# Altium schematic sheet Sheet3.SchDoc
size A4
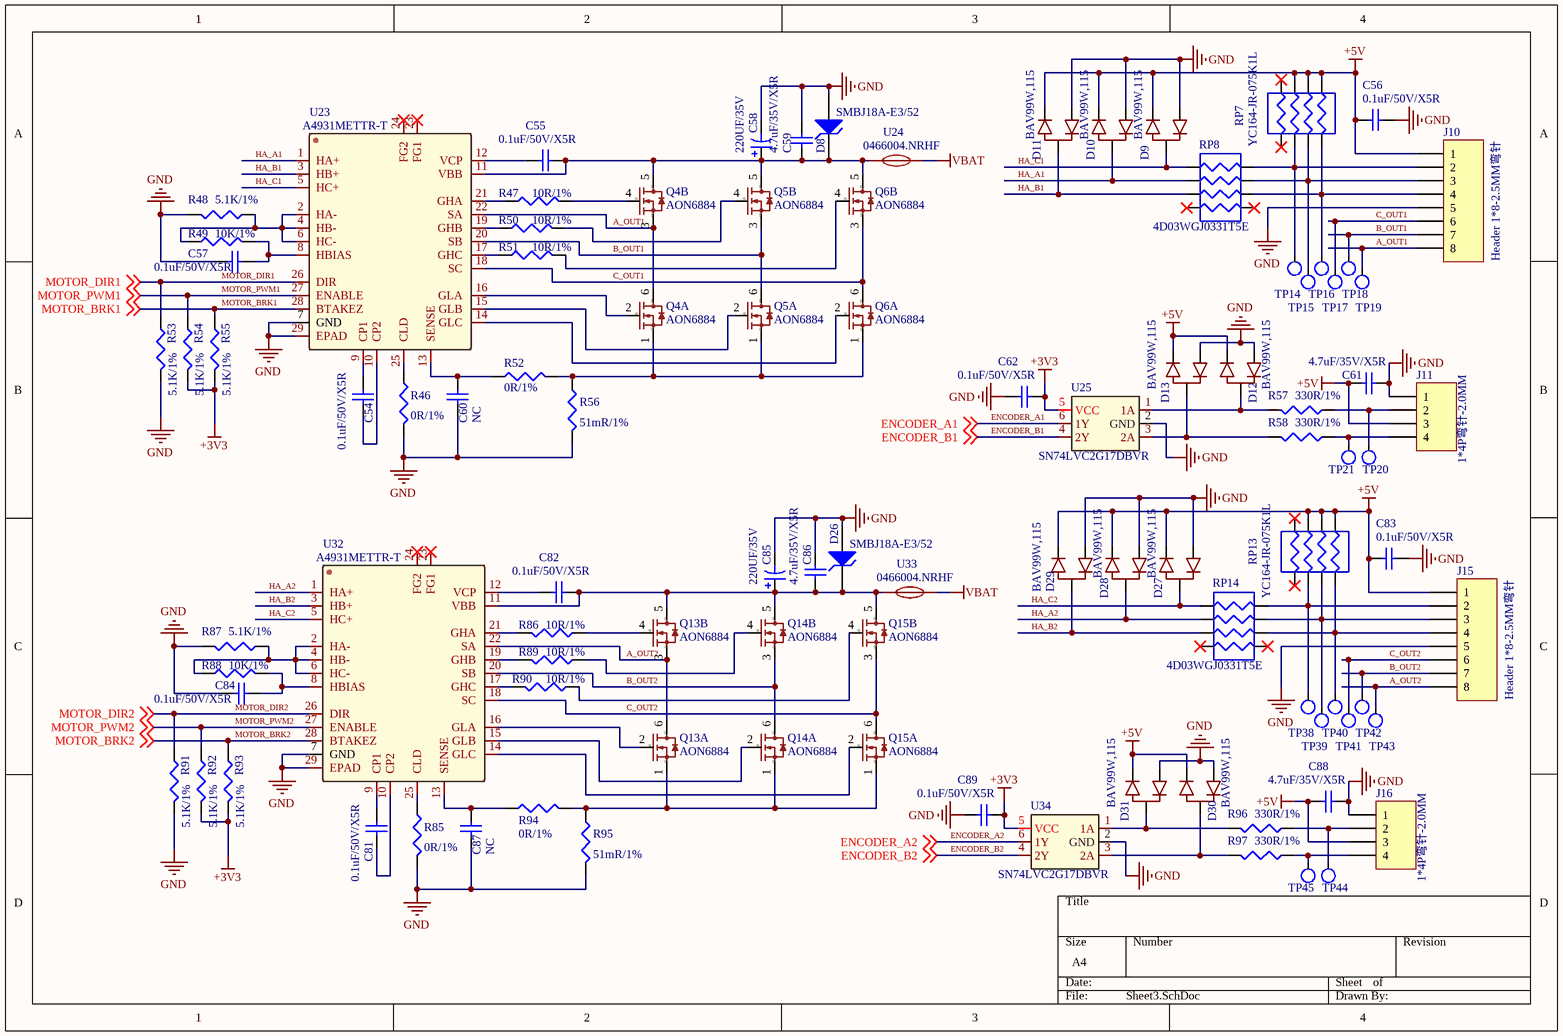
[diagram p0: Sheet3.SchDoc]

## Parts
C54  0.1uF/50V/X5R  [C0603]
C55  0.1uF/50V/X5R  [C0603]
C56  0.1uF/50V/X5R  [C0603]
C57  0.1uF/50V/X5R  [C0603]
C58  220UF/35V  [SMD_8X10.2]
C59  4.7uF/35V/X5R  [C0805]
C60  NC  [C0603]
C61  4.7uF/35V/X5R  [C0603]
C62  0.1uF/50V/X5R  [C0603]
C81  0.1uF/50V/X5R  [C0603]
C82  0.1uF/50V/X5R  [C0603]
C83  0.1uF/50V/X5R  [C0603]
C84  0.1uF/50V/X5R  [C0603]
C85  220UF/35V  [SMD_8X10.2]
C86  4.7uF/35V/X5R  [C0805]
C87  NC  [C0603]
C88  4.7uF/35V/X5R  [C0603]
C89  0.1uF/50V/X5R  [C0603]
D8  SMBJ18A-E3/52  [SMB]
D9  BAV99W,115
D10  BAV99W,115
D11  BAV99W,115
D12  BAV99W,115
D13  BAV99W,115
D26  SMBJ18A-E3/52  [SMB]
D27  BAV99W,115
D28  BAV99W,115
D29  BAV99W,115
D30  BAV99W,115
D31  BAV99W,115
J10  Header 1*8-2.5MM弯针  [DIP_8X2.5]
J11  1*4P弯针-2.0MM  [DIP_4X2MM]
J15  Header 1*8-2.5MM弯针  [DIP_8X2.5]
J16  1*4P弯针-2.0MM  [DIP_4X2MM]
Q4  AON6884  [AOS]  (parts A,B of 2)
Q5  AON6884  [AOS]  (parts A,B of 2)
Q6  AON6884  (parts A,B of 2)
Q13  AON6884  [AOS]  (parts A,B of 2)
Q14  AON6884  [AOS]  (parts A,B of 2)
Q15  AON6884  [AOS]  (parts A,B of 2)
R46  0R/1%  [R0603]
R47  10R/1%  [R0603]
R48  5.1K/1%  [R0603]
R49  10K/1%  [R0603]
R50  10R/1%  [R0603]
R51  10R/1%  [R0603]
R52  0R/1%  [R0603]
R53  5.1K/1%  [R0603]
R54  5.1K/1%  [R0603]
R55  5.1K/1%  [R0603]
R56  51mR/1%  [R0805]
R57  330R/1%  [R0603]
R58  330R/1%  [R0603]
R85  0R/1%  [R0603]
R86  10R/1%  [R0603]
R87  5.1K/1%  [R0603]
R88  10K/1%  [R0603]
R89  10R/1%  [R0603]
R90  10R/1%  [R0603]
R91  5.1K/1%  [R0603]
R92  5.1K/1%  [R0603]
R93  5.1K/1%  [R0603]
R94  0R/1%  [R0603]
R95  51mR/1%  [R0805]
R96  330R/1%  [R0603]
R97  330R/1%  [R0603]
RP7  YC164-JR-075K1L  [RP-1206]
RP8  4D03WGJ0331T5E  [RP-1206]
RP13  YC164-JR-075K1L  [RP-1206]
RP14  4D03WGJ0331T5E  [RP-1206]
TP14  TP  [TP]  (value not drawn)
TP15  TP  [TP]  (value not drawn)
TP16  TP  [TP]  (value not drawn)
TP17  TP  [TP]  (value not drawn)
TP18  TP  [TP]  (value not drawn)
TP19  TP  [TP]  (value not drawn)
TP20  TP  [TP]  (value not drawn)
TP21  TP  [TP]  (value not drawn)
TP38  TP  [TP]  (value not drawn)
TP39  TP  [TP]  (value not drawn)
TP40  TP  [TP]  (value not drawn)
TP41  TP  [TP]  (value not drawn)
TP42  TP  [TP]  (value not drawn)
TP43  TP  [TP]  (value not drawn)
TP44  TP  [TP]  (value not drawn)
TP45  TP  [TP]  (value not drawn)
U23  A4931METTR-T  [QFN-28]
U24  0466004.NRHF  [1206]
U25  SN74LVC2G17DBVR  [SOT-23-6]
U32  A4931METTR-T  [QFN-28]
U33  0466004.NRHF  [1206]
U34  SN74LVC2G17DBVR  [SOT-23-6]

## Nets
+3V3: C62.1 C89.1 R54.2 R55.2 R92.2 R93.2 U25.5(VCC) U34.5(VCC)
+5V: C56.1 C61.2 C83.1 C88.1 D9.2 D10.2 D11.2 D12.2 D13.2 D27.2 D28.2 D29.2 D30.2 D31.2 J10.1 J11.3 J15.1 J16.3 RP7.1 RP7.2 RP7.3 RP13.1 RP13.2 RP13.3
GND: C56.2 C57.2 C58.2 C59.2 C60.2 C61.1 C62.2 C83.2 C84.1 C85.2 C86.2 C87.2 C88.2 C89.2 D8.1(A) D9.1 D10.1 D11.1 D12.1 D13.1 D26.1(A) D27.1 D28.1 D29.1 D30.1 D31.1 J10.5 J11.1 J15.5 J16.1 R46.2 R48.2 R53.2 R56.2 R85.2 R87.2 R91.2 R95.2 U23.7(GND) U23.29(EPAD) U25.2(GND) U32.7(GND) U32.29(EPAD) U34.2(GND)
VBAT: U24.2 U33.2
A_OUT1: J10.8 Q4.3(S) Q4.6 TP19.1 U23.22(SA)
A_OUT2: J15.8 Q13.3(S) Q13.6 TP43.1 U32.22(SA)
B_OUT1: J10.7 Q5.3(S) Q5.6 TP18.1 U23.20(SB)
B_OUT2: J15.7 Q14.3(S) Q14.6 TP42.1 U32.20(SB)
C_OUT1: J10.6 Q6.3(S) Q6.6 TP17.1 U23.18(SC)
C_OUT2: J15.6 Q15.3(S) Q15.6 TP41.1 U32.18(SC)
ENCODER_A1: U25.6(1Y) ; off-sheet ENCODER_A1
ENCODER_A2: U34.6(1Y) ; off-sheet ENCODER_A2
ENCODER_B1: U25.4(2Y) ; off-sheet ENCODER_B1
ENCODER_B2: U34.4(2Y) ; off-sheet ENCODER_B2
HA_A1: D10.3 RP8.2 U23.1(HA+)
HA_A2: D28.3 RP14.2 U32.1(HA+)
HA_B1: D11.3 RP8.3 U23.3(HB+)
HA_B2: D29.3 RP14.3 U32.3(HB+)
HA_C1: D9.3 RP8.1 U23.5(HC+)
HA_C2: D27.3 RP14.1 U32.5(HC+)
MOTOR_BRK1: R55.1 U23.28(BTAKEZ) ; off-sheet MOTOR_BRK1
MOTOR_BRK2: R93.1 U32.28(BTAKEZ) ; off-sheet MOTOR_BRK2
MOTOR_DIR1: R53.1 U23.26(DIR) ; off-sheet MOTOR_DIR1
MOTOR_DIR2: R91.1 U32.26(DIR) ; off-sheet MOTOR_DIR2
MOTOR_PWM1: R54.1 U23.27(ENABLE) ; off-sheet MOTOR_PWM1
MOTOR_PWM2: R92.1 U32.27(ENABLE) ; off-sheet MOTOR_PWM2
NetC54_1: C54.1 U23.9(CP1)
NetC54_2: C54.2 U23.10(CP2)
NetC55_1: C55.1 U23.12(VCP)
NetC55_2: C55.2 C58.1 C59.1 D8.2(K) Q4.5(D) Q5.5(D) Q6.5(D) U23.11(VBB) U24.1
NetC57_1: C57.1 R49.2 U23.8(HBIAS)
NetC60_1: C60.1 R52.1 U23.13(SENSE)
NetC81_1: C81.1 U32.9(CP1)
NetC81_2: C81.2 U32.10(CP2)
NetC82_1: C82.1 U32.12(VCP)
NetC82_2: C82.2 C85.1 C86.1 D26.2(K) Q13.5(D) Q14.5(D) Q15.5(D) U32.11(VBB) U33.1
NetC84_2: C84.2 R88.2 U32.8(HBIAS)
NetC87_1: C87.1 R94.1 U32.13(SENSE)
NetD12_3: D12.3 R57.2 U25.1(1A)
NetD13_3: D13.3 R58.2 U25.3(2A)
NetD30_3: D30.3 R97.2 U34.3(2A)
NetD31_3: D31.3 R96.2 U34.1(1A)
NetJ10_2: J10.2 RP7.6 RP8.8 TP14.1
NetJ10_3: J10.3 RP7.7 RP8.7 TP15.1
NetJ10_4: J10.4 RP7.8 RP8.6 TP16.1
NetJ11_2: J11.2 R57.1 TP20.1
NetJ11_4: J11.4 R58.1 TP21.1
NetJ15_2: J15.2 RP13.6 RP14.8 TP38.1
NetJ15_3: J15.3 RP13.7 RP14.7 TP39.1
NetJ15_4: J15.4 RP13.8 RP14.6 TP40.1
NetJ16_2: J16.2 R96.1 TP44.1
NetJ16_4: J16.4 R97.1 TP45.1
NetQ4_1: Q4.1(S) Q5.1(S) Q6.1(S) R52.2 R56.1
NetQ4_2: Q4.2(G) U23.16(GLA)
NetQ4_4: Q4.4(G) R47.2
NetQ5_2: Q5.2(G) U23.15(GLB)
NetQ5_4: Q5.4(G) R50.2
NetQ6_2: Q6.2(G) U23.14(GLC)
NetQ6_4: Q6.4(G) R51.2
NetQ13_1: Q13.1(S) Q14.1(S) Q15.1(S) R94.2 R95.1
NetQ13_2: Q13.2(G) U32.16(GLA)
NetQ13_4: Q13.4(G) R86.1
NetQ14_2: Q14.2(G) U32.15(GLB)
NetQ14_4: Q14.4(G) R89.1
NetQ15_2: Q15.2(G) U32.14(GLC)
NetQ15_4: Q15.4(G) R90.1
NetR46_1: R46.1 U23.25(CLD)
NetR47_1: R47.1 U23.21(GHA)
NetR48_1: R48.1 R49.1 U23.2(HA-) U23.4(HB-) U23.6(HC-)
NetR50_1: R50.1 U23.19(GHB)
NetR51_1: R51.1 U23.17(GHC)
NetR85_1: R85.1 U32.25(CLD)
NetR86_2: R86.2 U32.21(GHA)
NetR87_1: R87.1 R88.1 U32.2(HA-) U32.4(HB-) U32.6(HC-)
NetR89_2: R89.2 U32.19(GHB)
NetR90_2: R90.2 U32.17(GHC)

Not connected (* = marked no-connect by the designer): RP7 4* 5*; RP8 4* 5*; RP13 4* 5*; RP14 4* 5*; U23 23(FG1)* 24(FG2)*; U32 23(FG1)* 24(FG2)*

## Library data of the parts
C54-C57 C59-C62 C81-C84 C86-C89 = Cap Semi: Capacitor (Semiconductor SIM Model); Value: 100pF; Published: 8-Jun-2000; LatestRevisionDate: 29-May-2009; LatestRevisionNote: IPC-7351 Footprint Added.; PackageReference: C1206; Publisher: Altium Limited; PackageDescription: Chip Capacitor
C58 C85 = Cap Pol1: Polarized Capacitor (Radial); Value: 100pF; Published: 8-Jun-2000; LatestRevisionDate: 17-Jul-2002; LatestRevisionNote: Re-released for DXP Platform.; PackageReference: RB7.6-15; Publisher: Altium Limited; PackageDescription: Polarized Capacitor (Radial); 2 Leads
D8 D26 = D Zener: Zener Diode; Published: 8-Jun-2000; LatestRevisionDate: 17-Jul-2002; LatestRevisionNote: Re-released for DXP Platform.; PackageReference: DIODE-0.7; Publisher: Altium Limited; PackageDescription: Diode, Thru-Hole; 2 Leads; 0.7 in Pin Spacing
J10 J15 = Header 8: Header, 8-Pin; LatestRevisionDate: 17-Jul-2002; LatestRevisionNote: Re-released for DXP Platform.; Publisher: Altium Limited
J11 J16 = Header 4: Header, 4-Pin; LatestRevisionDate: 17-Jul-2002; LatestRevisionNote: Re-released for DXP Platform.; Publisher: Altium Limited
R46-R58 R85-R97 = Res3: Resistor; Value: 1K; Published: 8-Jun-2000; LatestRevisionDate: 29-May-2009; LatestRevisionNote: IPC-7351 Footprint Added.; PackageReference: J1-0603; Publisher: Altium Limited; PackageDescription: Chip Resistor
RP7 RP8 RP13 RP14 = RP